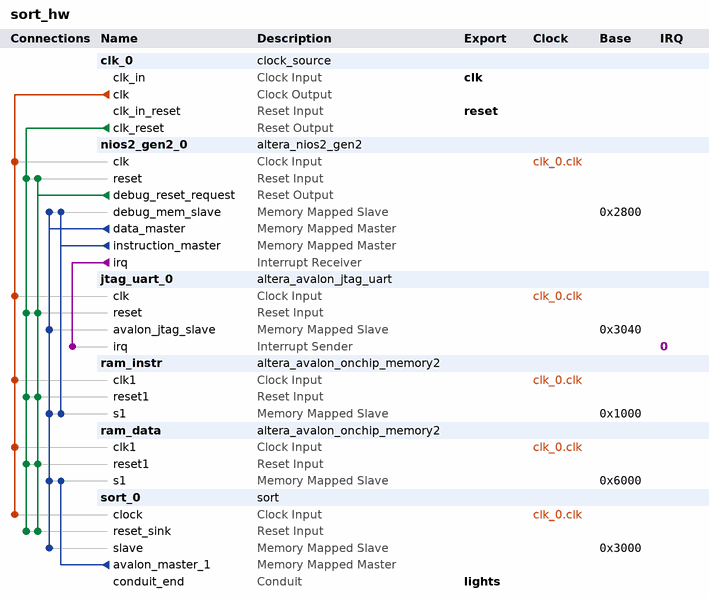
[diagram p0: system contents]
# Platform Designer (Qsys) system sort_hw, Cyclone V 5CSEMA5F31C6
# Parameters at their usual value, and those the tool derives, are not listed.
package require -exact qsys 18.1
create_system sort_hw
set_project_property DEVICE_FAMILY {Cyclone V}
set_project_property DEVICE 5CSEMA5F31C6

add_instance clk_0 clock_source 18.1
set_instance_parameter_value clk_0 clockFrequency 50000000

add_instance nios2_gen2_0 altera_nios2_gen2 18.1
set_instance_parameter_value nios2_gen2_0 dcache_size 2048
set_instance_parameter_value nios2_gen2_0 exceptionSlave ram_instr.s1
set_instance_parameter_value nios2_gen2_0 icache_size 4096
set_instance_parameter_value nios2_gen2_0 impl Tiny
set_instance_parameter_value nios2_gen2_0 resetSlave ram_instr.s1

add_instance jtag_uart_0 altera_avalon_jtag_uart 18.1
set_instance_parameter_value jtag_uart_0 simInteractiveOptions NO_INTERACTIVE_WINDOWS

add_instance ram_instr altera_avalon_onchip_memory2 18.1
set_instance_parameter_value ram_instr dataWidth 32
set_instance_parameter_value ram_instr dualPort false
set_instance_parameter_value ram_instr initMemContent true
set_instance_parameter_value ram_instr initializationFileName onchip_mem.hex
set_instance_parameter_value ram_instr memorySize 4096

add_instance ram_data altera_avalon_onchip_memory2 18.1
set_instance_parameter_value ram_data dataWidth 32
set_instance_parameter_value ram_data dualPort false
set_instance_parameter_value ram_data initMemContent true
set_instance_parameter_value ram_data initializationFileName onchip_mem.hex
set_instance_parameter_value ram_data memorySize 8192

add_instance sort_0 sort 1.0

# connections
add_connection clk_0.clk jtag_uart_0.clk clock
add_connection clk_0.clk nios2_gen2_0.clk clock
add_connection clk_0.clk ram_data.clk1 clock
add_connection clk_0.clk ram_instr.clk1 clock
add_connection clk_0.clk sort_0.clock clock
add_connection clk_0.clk_reset jtag_uart_0.reset reset
add_connection clk_0.clk_reset nios2_gen2_0.reset reset
add_connection clk_0.clk_reset ram_data.reset1 reset
add_connection clk_0.clk_reset ram_instr.reset1 reset
add_connection clk_0.clk_reset sort_0.reset_sink reset
add_connection nios2_gen2_0.debug_reset_request jtag_uart_0.reset reset
add_connection nios2_gen2_0.debug_reset_request nios2_gen2_0.reset reset
add_connection nios2_gen2_0.debug_reset_request ram_data.reset1 reset
add_connection nios2_gen2_0.debug_reset_request ram_instr.reset1 reset
add_connection nios2_gen2_0.debug_reset_request sort_0.reset_sink reset
add_connection nios2_gen2_0.data_master jtag_uart_0.avalon_jtag_slave avalon
set_connection_parameter_value nios2_gen2_0.data_master/jtag_uart_0.avalon_jtag_slave baseAddress 0x3040
add_connection nios2_gen2_0.data_master nios2_gen2_0.debug_mem_slave avalon
set_connection_parameter_value nios2_gen2_0.data_master/nios2_gen2_0.debug_mem_slave baseAddress 0x2800
add_connection nios2_gen2_0.data_master ram_data.s1 avalon
set_connection_parameter_value nios2_gen2_0.data_master/ram_data.s1 baseAddress 0x6000
add_connection nios2_gen2_0.data_master ram_instr.s1 avalon
set_connection_parameter_value nios2_gen2_0.data_master/ram_instr.s1 baseAddress 0x1000
add_connection nios2_gen2_0.data_master sort_0.slave avalon
set_connection_parameter_value nios2_gen2_0.data_master/sort_0.slave baseAddress 0x3000
add_connection nios2_gen2_0.instruction_master nios2_gen2_0.debug_mem_slave avalon
set_connection_parameter_value nios2_gen2_0.instruction_master/nios2_gen2_0.debug_mem_slave baseAddress 0x2800
add_connection nios2_gen2_0.instruction_master ram_instr.s1 avalon
set_connection_parameter_value nios2_gen2_0.instruction_master/ram_instr.s1 baseAddress 0x1000
add_connection sort_0.avalon_master_1 ram_data.s1 avalon
set_connection_parameter_value sort_0.avalon_master_1/ram_data.s1 baseAddress 0x6000
add_connection nios2_gen2_0.irq jtag_uart_0.irq interrupt
set_connection_parameter_value nios2_gen2_0.irq/jtag_uart_0.irq irqNumber 0

# exported interfaces
add_interface clk clock sink
set_interface_property clk EXPORT_OF clk_0.clk_in
add_interface lights conduit end
set_interface_property lights EXPORT_OF sort_0.conduit_end
add_interface reset reset sink
set_interface_property reset EXPORT_OF clk_0.clk_in_reset

set_interconnect_requirement {$system} qsys_mm.clockCrossingAdapter HANDSHAKE
set_interconnect_requirement {$system} qsys_mm.enableEccProtection FALSE
set_interconnect_requirement {$system} qsys_mm.insertDefaultSlave FALSE
set_interconnect_requirement {$system} qsys_mm.maxAdditionalLatency 1

save_system sort_hw.qsys
